# EAGLE design AVATAR pic18f4550 (EAGLE 7.6.0)
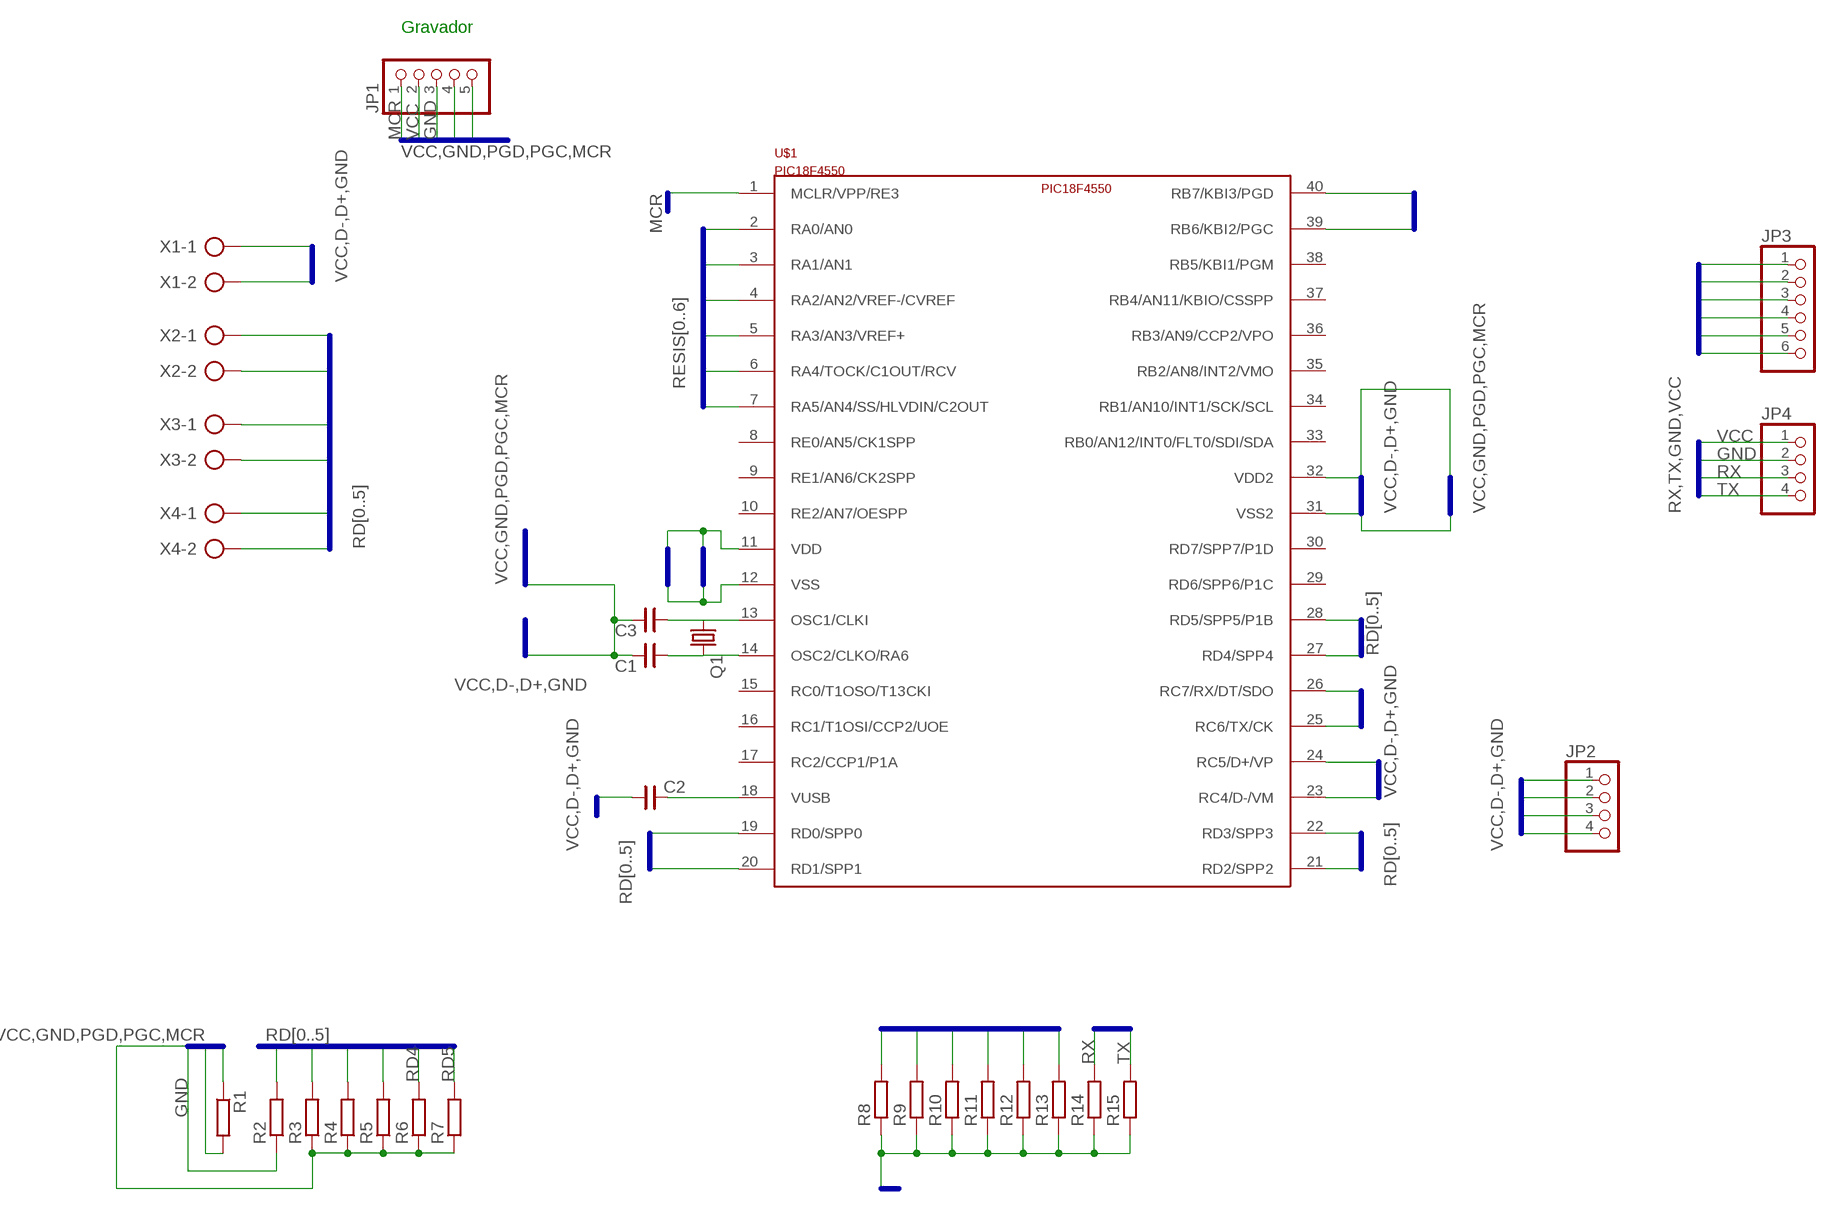
[diagram p0: schematic, sheet 1]

## Parts
C1  CBP-ENP-015-040  [ENP-015-040]
C2  CBP-ENP-025-060  [ENP-025-060]
C3  CBP-ENP-015-040  [ENP-015-040]
JP1  PINHD-1X5  [1X05]
JP2  PINHD-1X4  [1X04]
JP3  PINHD-1X6  [1X06]
JP4  PINHD-1X4  [1X04]
Q1  CRYTALHC49S  [HC49/S]
R1  R-EU_0207/12  [0207/12]
R2  R-EU_0207/12  [0207/12]
R3  R-EU_0207/12  [0207/12]
R4  R-EU_0207/12  [0207/12]
R5  R-EU_0207/12  [0207/12]
R6  R-EU_0207/12  [0207/12]
R7  R-EU_0207/12  [0207/12]
R8  R-EU_0207/12  [0207/12]
R9  R-EU_0207/12  [0207/12]
R10  R-EU_0207/12  [0207/12]
R11  R-EU_0207/12  [0207/12]
R12  R-EU_0207/12  [0207/12]
R13  R-EU_0207/12  [0207/12]
R14  R-EU_0207/12  [0207/12]
R15  R-EU_0207/12  [0207/12]
U$1  PIC18F4550  [PDIP-40]
X1  AK500/2  [AK500/2]
X2  AK500/2  [AK500/2]
X3  AK500/2  [AK500/2]
X4  AK500/2  [AK500/2]

## Nets
D+: JP2.3 U$1.24(RC5/D+/VP)
D-: JP2.4 U$1.23(RC4/D-/VM)
GND: C1.2 C2.1 C3.2 JP1.3 JP2.2 JP4.2 R2.1 R3.1 R4.1 R5.1 R6.1 R7.1 R8.1 R9.1 R10.1 R11.1 R12.1 R13.1 R14.1 R15.1 U$1.12(VSS) U$1.31(VSS2) X1.2
MCR: JP1.1 R1.1 U$1.1(MCLR/VPP/RE3)
N$1: C3.1 Q1.1 U$1.13(OSC1/CLKI)
N$2: C1.1 Q1.2 U$1.14(OSC2/CLKO/RA6)
N$3: C2.2 U$1.18(VUSB)
PGC: JP1.5 U$1.39(RB6/KBI2/PGC)
PGD: JP1.4 U$1.40(RB7/KBI3/PGD)
RD0: R2.2 U$1.19(RD0/SPP0) X2.2
RD1: R3.2 U$1.20(RD1/SPP1) X2.1
RD2: R5.2 U$1.21(RD2/SPP2) X3.1
RD3: R4.2 U$1.22(RD3/SPP3) X3.2
RD4: R6.2 U$1.27(RD4/SPP4) X4.2
RD5: R7.2 U$1.28(RD5/SPP5/P1B) X4.1
RESIS0: JP3.3 R8.2 U$1.2(RA0/AN0)
RESIS1: JP3.2 R9.2 U$1.3(RA1/AN1)
RESIS2: JP3.1 R10.2 U$1.4(RA2/AN2/VREF-/CVREF)
RESIS3: JP3.4 R11.2 U$1.5(RA3/AN3/VREF+)
RESIS4: JP3.5 R12.2 U$1.6(RA4/TOCK/C1OUT/RCV)
RESIS6: JP3.6 R13.2 U$1.7(RA5/AN4/SS/HLVDIN/C2OUT)
RX: JP4.3 R14.2 U$1.26(RC7/RX/DT/SDO)
TX: JP4.4 R15.2 U$1.25(RC6/TX/CK)
VCC: JP1.2 JP2.1 JP4.1 R1.2 U$1.11(VDD) U$1.32(VDD2) X1.1
Unconnected: U$1.8(RE0/AN5/CK1SPP) U$1.9(RE1/AN6/CK2SPP) U$1.10(RE2/AN7/OESPP) U$1.15(RC0/T1OSO/T13CKI) U$1.16(RC1/T1OSI/CCP2/UOE) U$1.17(RC2/CCP1/P1A) U$1.29(RD6/SPP6/P1C) U$1.30(RD7/SPP7/P1D) U$1.33(RB0/AN12/INT0/FLT0/SDI/SDA) U$1.34(RB1/AN10/INT1/SCK/SCL) U$1.35(RB2/AN8/INT2/VMO) U$1.36(RB3/AN9/CCP2/VPO) U$1.37(RB4/AN11/KBIO/CSSPP) U$1.38(RB5/KBI1/PGM)

## Buses
RD[0..5]
VCC,GND,PGD,PGC,MCR
VCC,D-,D+,GND
RESIS[0..6]
RX,TX
RX,TX,GND,VCC

## Notes on the sheet
- Gravador

## Library data of the parts
C1-C3 = cap-master:CBP-: BIPOLAR CAP
JP1 = pinhead:PINHD-1X5: PIN HEADER
JP2 JP4 = pinhead:PINHD-1X4: PIN HEADER
JP3 = pinhead:PINHD-1X6: PIN HEADER
Q1 = crystal:CRYTAL: CRYSTAL
R1-R15 = resistor:R-EU_: RESISTOR, European symbol
U$1 = pic18f4550:PIC18F4550
X1-X4 = con-ptr500:AK500/2: CONNECTOR; OC_FARNELL: unknown; OC_NEWARK: unknown

## Board
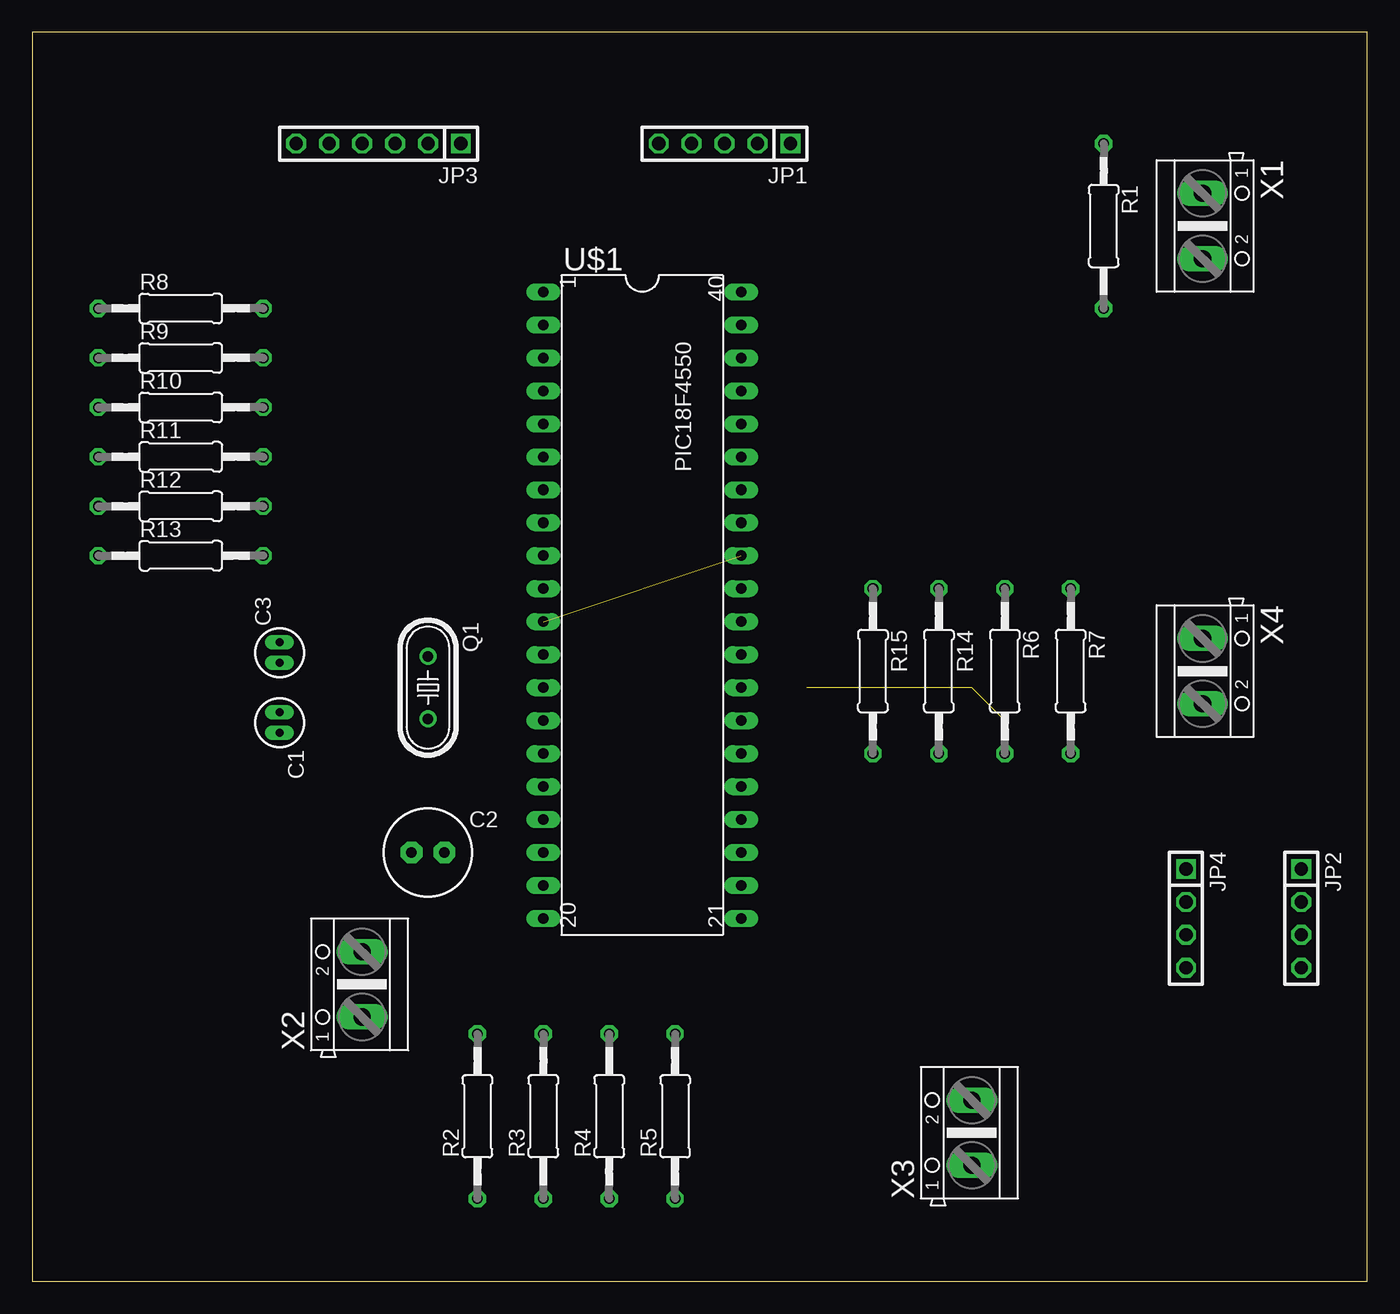
[diagram p1: board, top side]
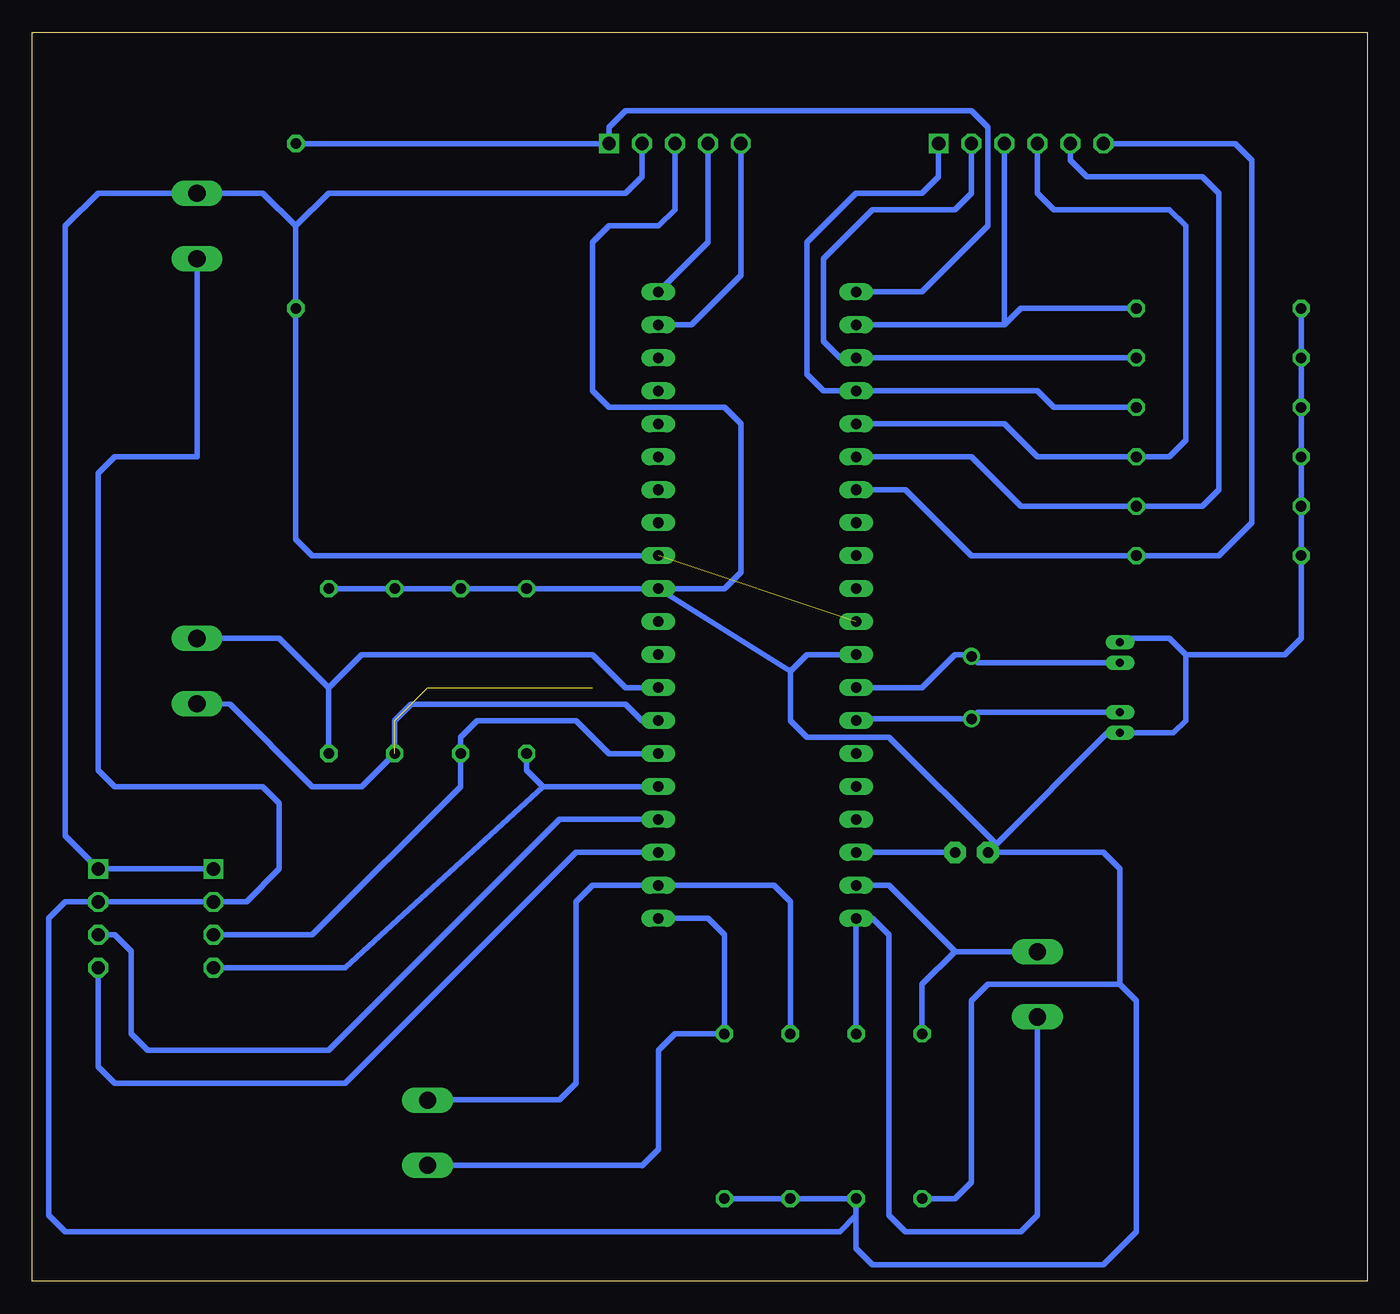
[diagram p2: board, bottom side, seen from below]

Size 102.85 x 96.19 mm. Coordinates in mm from the lower left corner, seen from the top.
Outline: 0,0 102.85,0 102.85,96.19 0,96.19 0,0
Copper layers (1*16): Top 0.035mm / dielectric 1.5mm / Bottom 0.035mm
Design rules "default": minimum track width 10mil, minimum drill 24mil, track to track 8mil, track to pad 8mil, pad to pad 8mil, via to via 8mil, smd to smd 8mil, copper to edge 40mil, drill to drill 8mil, minimum pad ring 10mil, minimum via ring 8mil, stop-mask expansion 4mil, vias tented up to drill 0mil, thermal gap 10mil

### Footprints (pad centres in the part's own frame; a part is rotated, then mirrored left to right if it is on the bottom)
ENP-015-040 = drill 0.61 pad 0.813 long: 1 -0.635,0; 2 0.953,0
ENP-025-060 = drill 0.813 pad 1.676 octagon: 1 -1.27,0; 2 1.27,0
1X05 = drill 1.016 square: 1 -5.08,0 | drill 1.016 octagon: 2 -2.54,0; 3 0,0; 4 2.54,0; 5 5.08,0
1X04 = drill 1.016 square: 1 -3.81,0 | drill 1.016 octagon: 2 -1.27,0; 3 1.27,0; 4 3.81,0
1X06 = drill 1.016 square: 1 -6.35,0 | drill 1.016 octagon: 2 -3.81,0; 3 -1.27,0; 4 1.27,0; 5 3.81,0; 6 6.35,0
HC49/S = drill 0.813: 1 -2.413,0; 2 2.413,0
0207/12 = drill 0.813 octagon: 1 -6.35,0; 2 6.35,0
PDIP-40 = drill 0.813 long: 1 -19.05,-8.89; 2 -16.51,-8.89; 3 -13.97,-8.89; 4 -11.43,-8.89; 5 -8.89,-8.89; 6 -6.35,-8.89; 7 -3.81,-8.89; 8 -1.27,-8.89; 9 1.27,-8.89; 10 3.81,-8.89; 11 6.35,-8.89; 12 8.89,-8.89; 13 11.43,-8.89; 14 13.97,-8.89; 15 16.51,-8.89; 16 19.05,-8.89; 17 21.59,-8.89; 18 24.13,-8.89; 19 26.67,-8.89; 20 29.21,-8.89; 21 29.21,6.35; 22 26.67,6.35; 23 24.13,6.35; 24 21.59,6.35; 25 19.05,6.35; 26 16.51,6.35; 27 13.97,6.35; 28 11.43,6.35; 29 8.89,6.35; 30 6.35,6.35; 31 3.81,6.35; 32 1.27,6.35; 33 -1.27,6.35; 34 -3.81,6.35; 35 -6.35,6.35; 36 -8.89,6.35; 37 -11.43,6.35; 38 -13.97,6.35; 39 -16.51,6.35; 40 -19.05,6.35
AK500/2 = drill 1.321 long: 1 -2.515,0; 2 2.515,0

### Placement (x,y rotation side)
C1  19.05,43.18 270 top
C2  30.48,33.02 0 top
C3  19.05,48.26 90 top
JP1  53.34,87.63 180 top
JP2  97.79,27.94 270 top
JP3  26.67,87.63 180 top
JP4  88.9,27.94 270 top
Q1  30.48,45.72 270 top
R1  82.55,81.28 270 top
R2  34.29,12.7 90 top
R3  39.37,12.7 90 top
R4  44.45,12.7 90 top
R5  49.53,12.7 90 top
R6  74.93,46.99 270 top
R7  80.01,46.99 270 top
R8  11.43,74.93 0 top
R9  11.43,71.12 0 top
R10  11.43,67.31 0 top
R11  11.43,63.5 0 top
R12  11.43,59.69 0 top
R13  11.43,55.88 0 top
R14  69.85,46.99 270 top
R15  64.77,46.99 270 top
U$1  48.26,57.15 270 top
X1  90.17,81.28 270 top
X2  25.4,22.86 90 top
X3  72.39,11.43 90 top
X4  90.17,46.99 270 top

### Tracks (layer width: path | path; a pad name or v marks a point on that pad's centre or on a via)
D+
  Bottom 0.406: JP2.3 96.52,26.67 95.25,25.4 95.25,19.05 93.98,17.78 80.01,17.78 62.23,35.56 U$1.24
D-
  Bottom 0.406: U$1.23 60.96,33.02 78.74,15.24 96.52,15.24 97.79,16.51 JP2.4
GND
  Bottom 0.406: 28.57,33.66 20,42.23 C1.2 14.92,42.23 13.97,43.18 13.97,48.26 | 28.57,33.66 C2.1 20.32,33.02 19.05,31.75 19.05,22.86 | U$1.31 R15.1 R14.1 R6.1 R7.1 | 13.97,48.26 15.24,49.53 18.73,49.53 C3.2 | 13.97,48.26 6.35,48.26 5.08,49.53 R13.1 R12.1 R11.1 R10.1 R9.1 R8.1 | X1.2 90.17,63.5 96.52,63.5 97.79,62.23 97.79,39.37 96.52,38.1 85.09,38.1 83.82,36.83 83.82,31.75 86.36,29.21 JP4.2 JP2.2 100.33,29.21 101.6,27.94 101.6,5.08 100.33,3.81 40.64,3.81 39.37,5.08 | U$1.12 43.18,48.26 44.45,46.99 | 44.45,46.99 44.45,43.18 43.18,41.91 36.83,41.91 28.57,33.66 | R5.1 R4.1 R3.1 39.37,5.08 | R2.1 31.75,6.35 30.48,7.62 30.48,21.59 29.21,22.86 19.05,22.86 | 19.05,22.86 17.78,21.59 17.78,3.81 20.32,1.27 38.1,1.27 39.37,2.54 39.37,5.08 | U$1.31 44.45,46.99 | U$1.31 49.53,53.34 48.26,54.61 48.26,66.04 49.53,67.31 58.42,67.31 59.69,68.58 59.69,80.01 58.42,81.28 54.61,81.28 53.34,82.55 JP1.3
MCR
  Bottom 0.406: U$1.1 34.29,76.2 29.21,81.28 29.21,88.9 30.48,90.17 57.15,90.17 58.42,88.9 JP1.1 R1.1
N$1
  Bottom 0.406: C3.1 29.97,47.62 Q1.1 30.61,48.26 31.75,48.26 34.29,45.72 U$1.13
N$2
  Bottom 0.406: C1.1 29.97,43.81 Q1.2 39.24,43.31 U$1.14
N$3
  Bottom 0.406: C2.2 U$1.18
PGC
  Bottom 0.406: U$1.39 52.07,73.66 48.26,77.47 JP1.5
PGD
  Bottom 0.406: U$1.40 50.8,80.01 JP1.4
RD0
  Bottom 0.406: X2.2 31.73,25.38 | 31.73,25.38 36.83,30.48 U$1.19 | 31.73,25.38 31.77,25.38 34.29,22.86 R2.2
RD1
  Bottom 0.406: X2.1 25.4,5.08 26.67,3.81 35.56,3.81 36.83,5.08 36.83,26.67 38.1,27.94 U$1.20 R3.2
RD2
  Bottom 0.406: U$1.21 50.8,27.94 49.53,26.67 R5.2 53.34,19.05 54.61,17.78 54.61,10.16 55.88,8.89 55.9,8.92 X3.1
RD3
  Bottom 0.406: R4.2 44.45,29.21 45.72,30.48 U$1.22 59.69,30.48 60.96,29.21 60.96,15.24 62.23,13.97 72.37,13.97 X3.2
RD4  (3 unrouted)
  Bottom 0.406: X4.2 87.63,44.45 81.28,38.1 77.47,38.1 R6.2 74.93,43.18 73.66,44.45 57.15,44.45 55.88,43.18 U$1.27
RD5
  Bottom 0.406: 80.01,45.72 R7.2 | X4.1 83.82,49.53 80.01,45.72 | U$1.28 57.15,45.72 59.69,48.26 77.47,48.26 80.01,45.72
RESIS0
  Bottom 0.406: R8.2 26.67,74.93 27.94,73.66 | 27.94,73.66 U$1.2 | JP3.3 27.94,73.66
RESIS1
  Bottom 0.406: R9.2 U$1.3 40.64,71.12 41.91,72.39 41.91,78.74 38.1,82.55 31.75,82.55 30.48,83.82 JP3.2
RESIS2
  Bottom 0.406: R10.2 24.13,67.31 25.4,68.58 U$1.4 41.91,68.58 43.18,69.85 43.18,80.01 39.37,83.82 34.29,83.82 33.02,85.09 JP3.1
RESIS3
  Bottom 0.406: U$1.5 27.94,66.04 25.4,63.5 R11.2 15.24,63.5 13.97,64.77 13.97,81.28 15.24,82.55 24.13,82.55 25.4,83.82 JP3.4
RESIS4
  Bottom 0.406: U$1.6 30.48,63.5 26.67,59.69 R12.2 12.7,59.69 11.43,60.96 11.43,83.82 12.7,85.09 21.59,85.09 22.86,86.36 JP3.5
RESIS6
  Bottom 0.406: U$1.7 35.56,60.96 30.48,55.88 R13.2 11.43,55.88 8.89,58.42 8.89,86.36 10.16,87.63 JP3.6
RX
  Bottom 0.406: JP4.3 81.28,26.67 69.85,38.1 R14.2 69.85,41.91 68.58,43.18 60.96,43.18 58.42,40.64 U$1.26
TX
  Bottom 0.406: U$1.25 63.5,38.1 | 63.5,38.1 64.77,39.37 R15.2 | JP4.4 78.74,24.13 63.5,38.1
VCC  (1 unrouted)
  Bottom 0.406: JP4.1 JP2.1 100.33,34.29 100.33,81.28 97.79,83.82 X1.1 86.36,83.82 85.09,83.82 82.55,81.28 | JP1.2 55.88,85.09 57.15,83.82 80.01,83.82 82.55,81.28 | 82.55,81.28 R1.2 82.55,57.15 81.28,55.88 U$1.32